# Altium schematic sheet key_pads_sch_V3.SchDoc
size E; DrawnBy: huyong; Engineer: huyong; Organization: LINSN; Address3: http://www.linsn.com/; Revision: V1.0.0
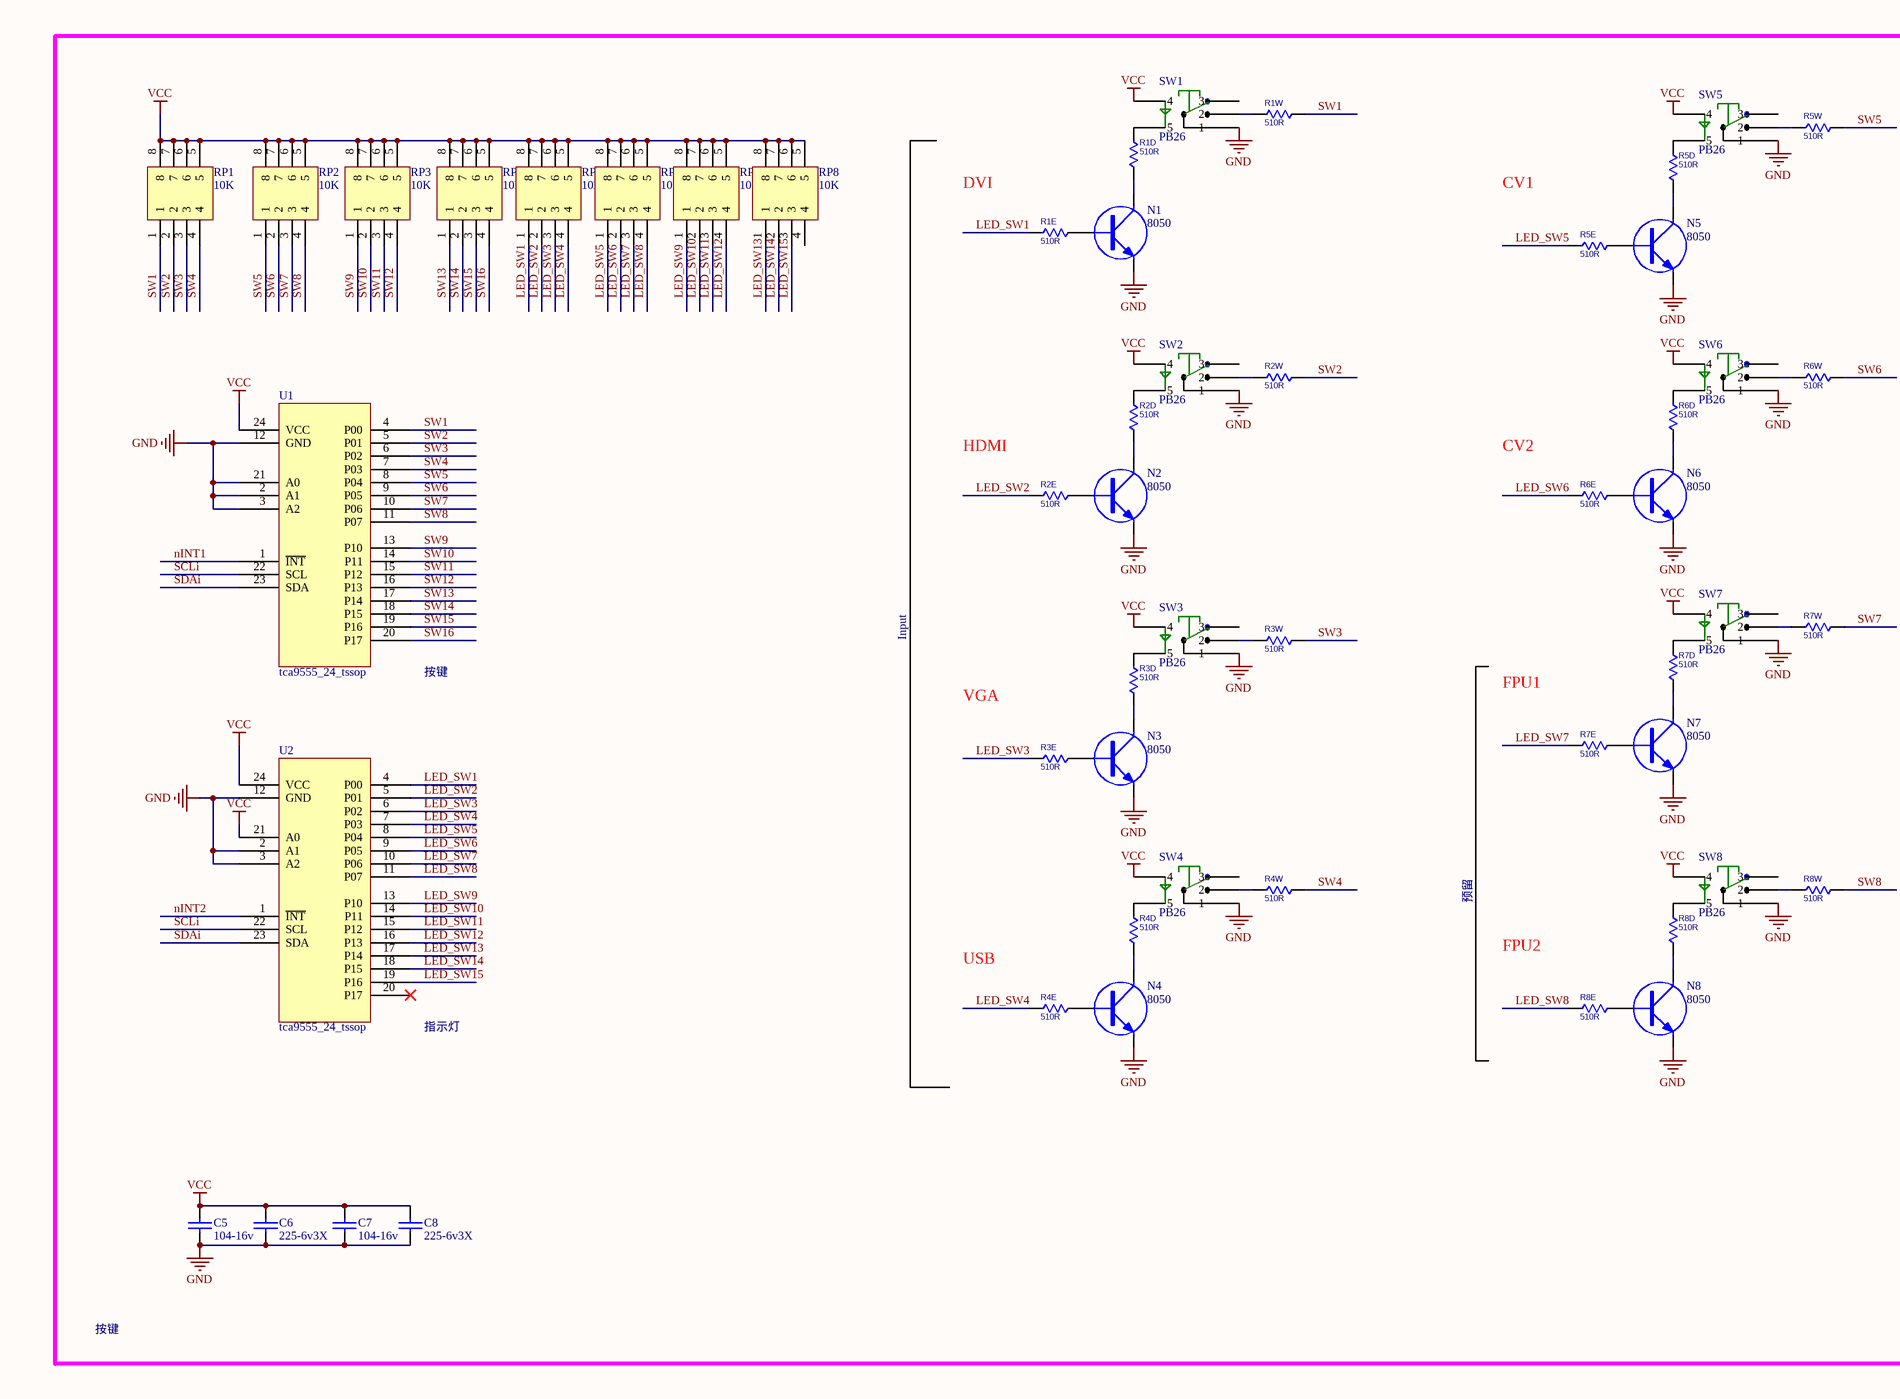
[diagram p0: key_pads_sch_V3.SchDoc, top left]
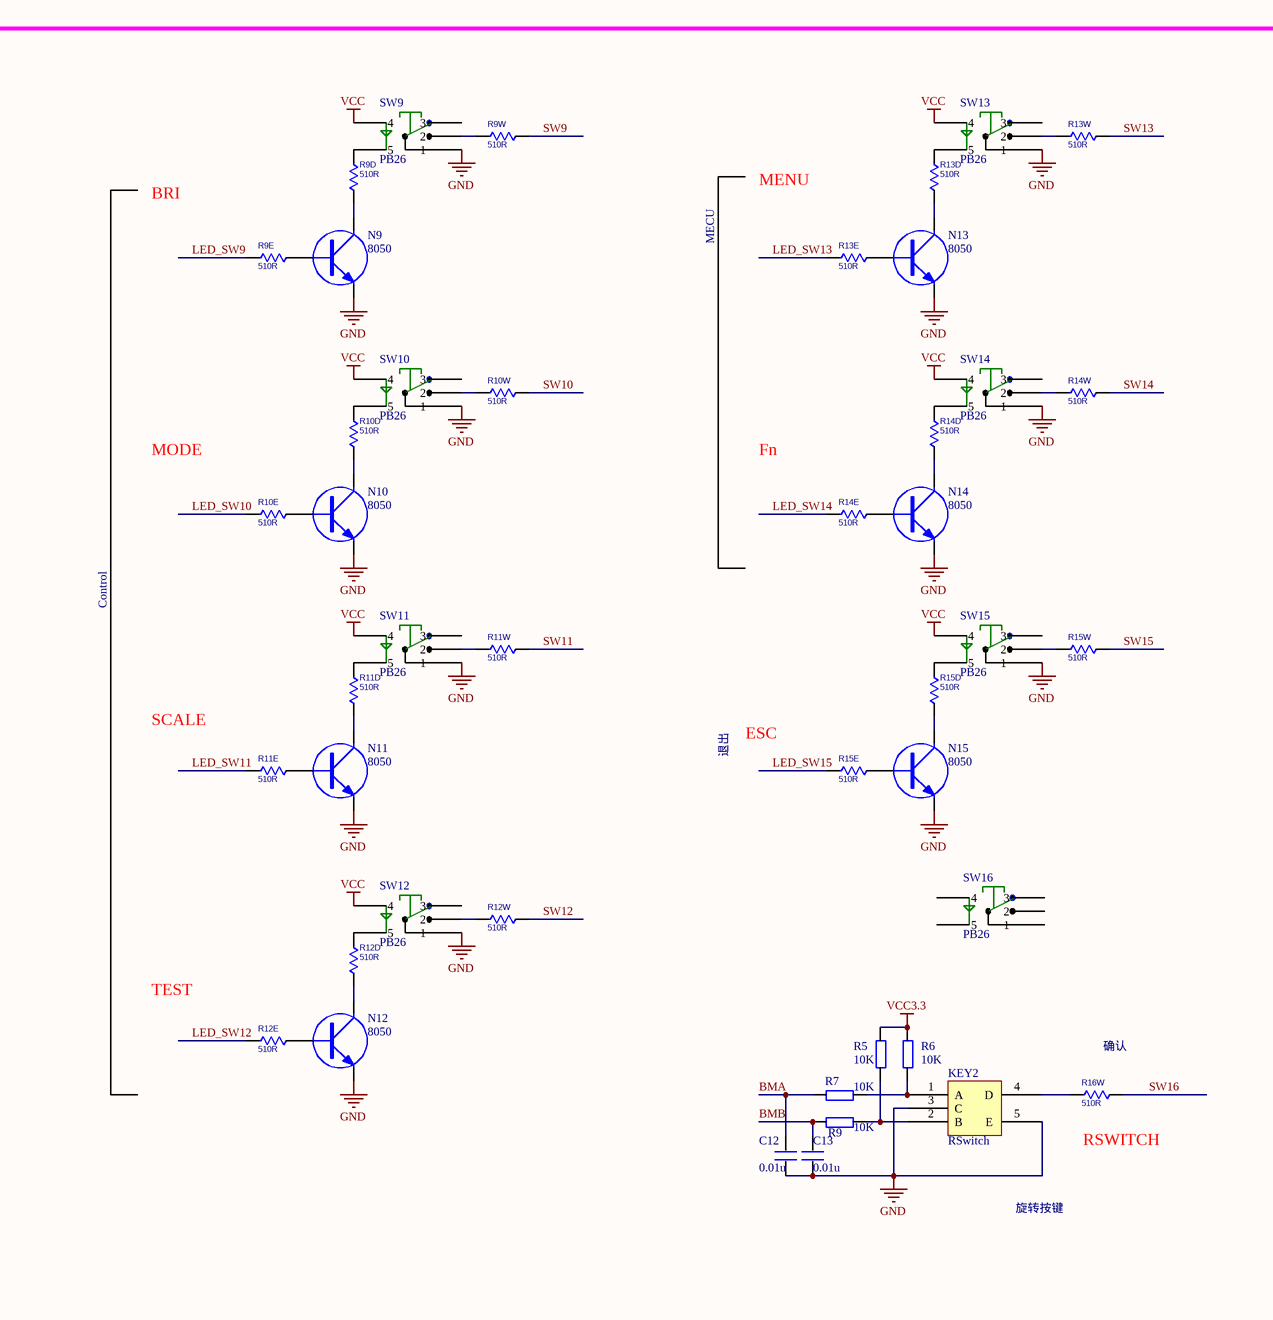
[diagram p1: key_pads_sch_V3.SchDoc, top right]
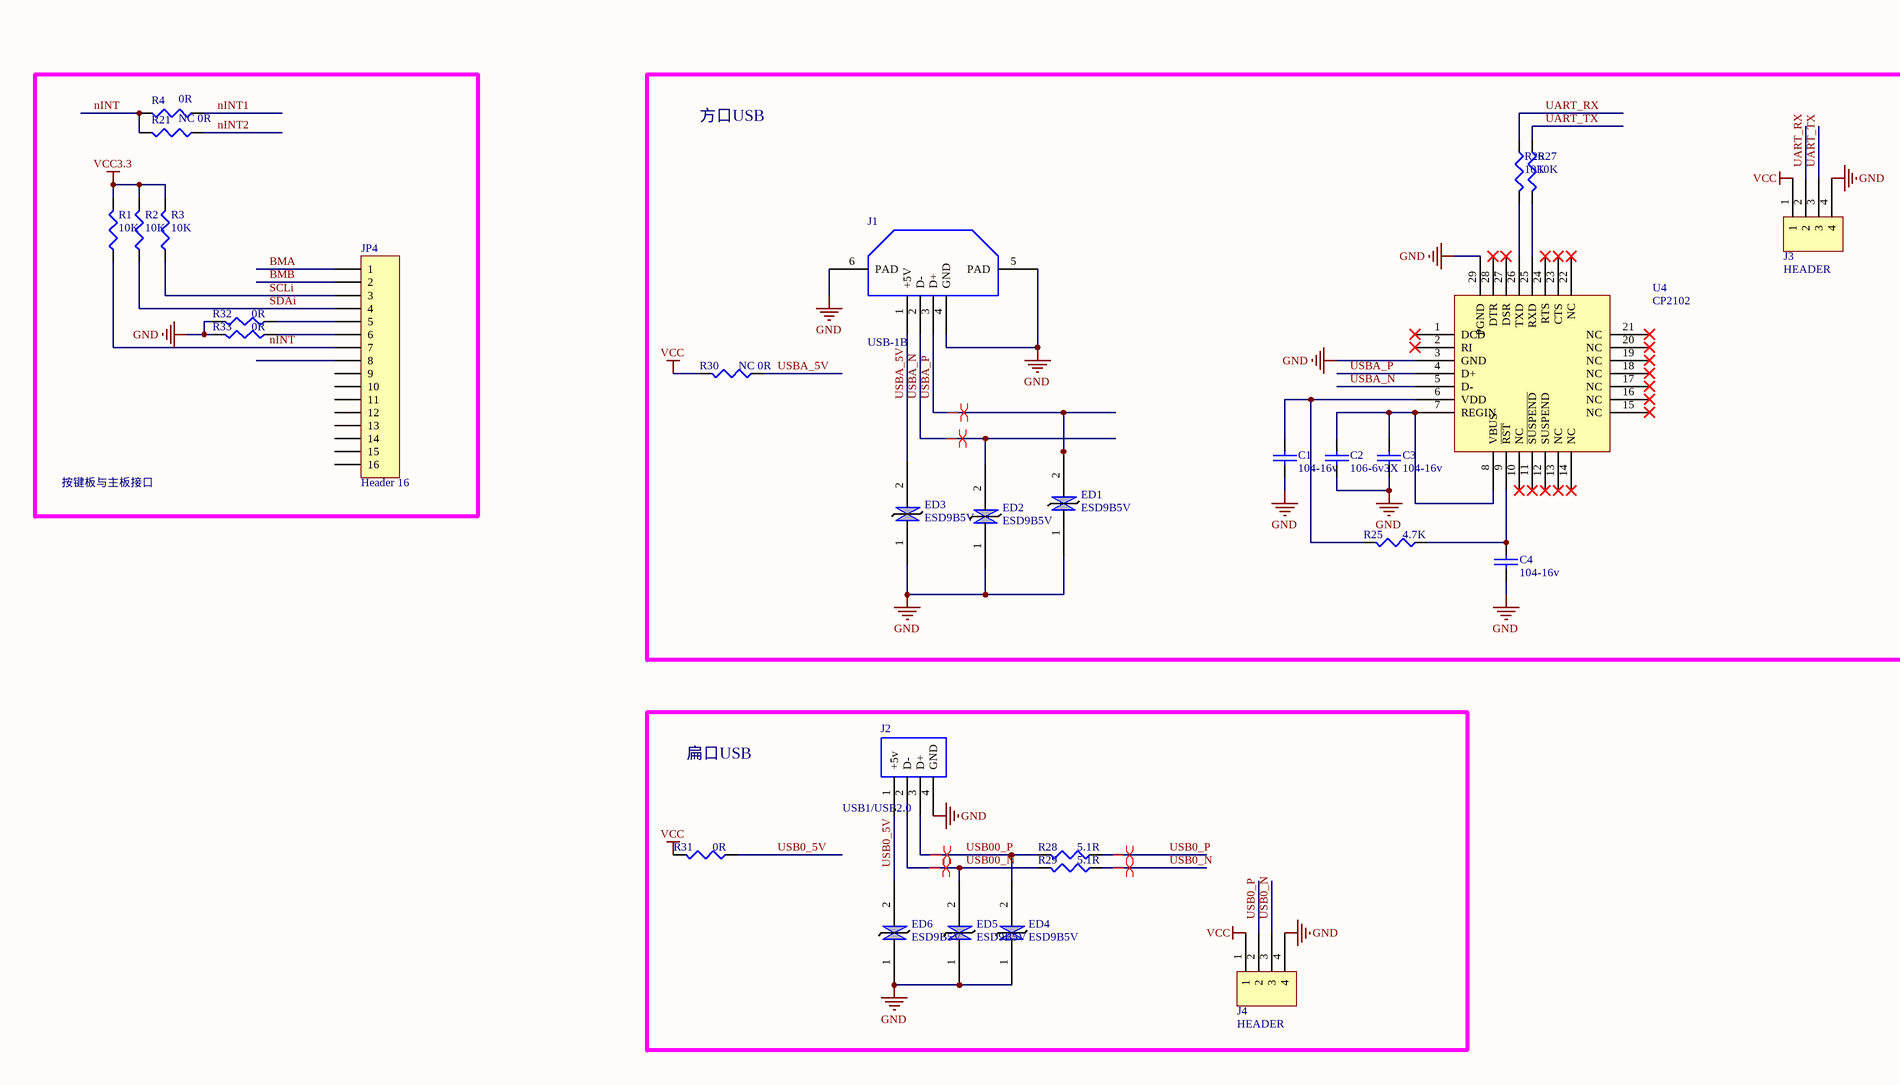
[diagram p2: key_pads_sch_V3.SchDoc, bottom left]
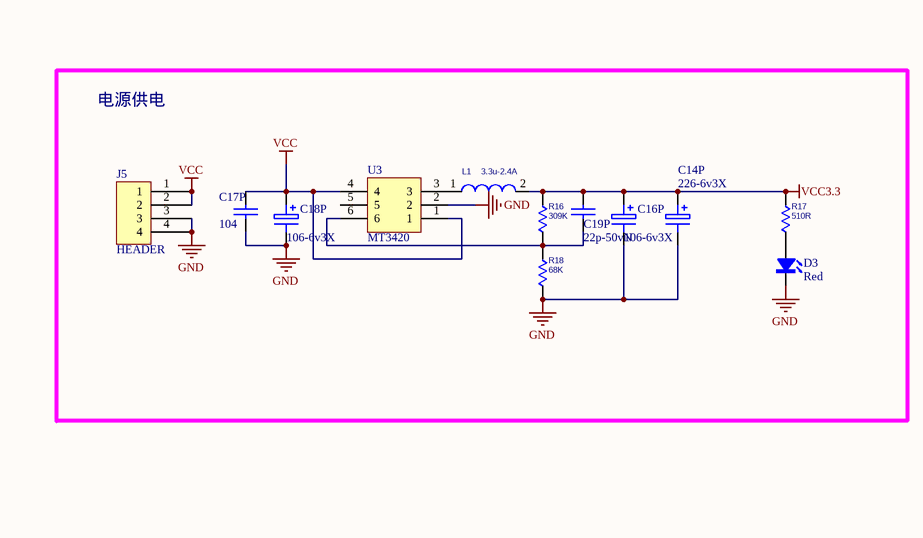
[diagram p3: key_pads_sch_V3.SchDoc, bottom right]

## Parts
C1  104-16v  [C0402]
C2  106-6v3X  [C0402]
C3  104-16v  [C0402]
C4  104-16v  [C0402]
C5  104-16v  [C0402]
C6  225-6v3X  [C0402]
C7  104-16v  [C0402]
C8  225-6v3X  [C0402]
C12  0.01u  [R0402]
C13  0.01u  [R0402]
C14P  226-6v3X  [C0805]
C16P  106-6v3X  [C0603]
C17P  104  [C0402]
C18P  106-6v3X  [C0603]
C19P  22p-50vN  [C0402]
D3  Red  [led0603]
ED1  ESD9B5V  [E0402N]
ED2  ESD9B5V  [E0402N]
ED3  ESD9B5V  [E0402N]
ED4  ESD9B5V  [E0402N]
ED5  ESD9B5V  [E0402N]
ED6  ESD9B5V  [E0402N]
J1  USB-1B  [USB_BF_180]
J2  USB1/USB2.0  [USB_AF_180]
J3  HEADER  [SIP4-2.54]
J4  HEADER  [SIP4-2.54]
J5  HEADER  [SIP4-2.54]
JP4  Header 16  [DJ16J]
KEY2  RSwitch  [RSwitch]
L1  3.3u-2.4A  [L5040]
N1  8050  [sot-23]
N2  8050  [sot-23]
N3  8050  [sot-23]
N4  8050  [sot-23]
N5  8050  [sot-23]
N6  8050  [sot-23]
N7  8050  [sot-23]
N8  8050  [sot-23]
N9  8050  [sot-23]
N10  8050  [sot-23]
N11  8050  [sot-23]
N12  8050  [sot-23]
N13  8050  [sot-23]
N14  8050  [sot-23]
N15  8050  [sot-23]
R1  10K  [R0402]
R1D  510R  [R0402]
R1E  510R  [R0402]
R1W  510R  [R0402]
R2  10K  [R0402]
R2D  510R  [R0402]
R2E  510R  [R0402]
R2W  510R  [R0402]
R3  10K  [R0402]
R3D  510R  [R0402]
R3E  510R  [R0402]
R3W  510R  [R0402]
R4  0R  [R0402]
R4D  510R  [R0402]
R4E  510R  [R0402]
R4W  510R  [R0402]
R5  10K  [R0402]
R5D  510R  [R0402]
R5E  510R  [R0402]
R5W  510R  [R0402]
R6  10K  [R0402]
R6D  510R  [R0402]
R6E  510R  [R0402]
R6W  510R  [R0402]
R7  10K  [R0402]
R7D  510R  [R0402]
R7E  510R  [R0402]
R7W  510R  [R0402]
R8D  510R  [R0402]
R8E  510R  [R0402]
R8W  510R  [R0402]
R9  10K  [R0402]
R9D  510R  [R0402]
R9E  510R  [R0402]
R9W  510R  [R0402]
R10D  510R  [R0402]
R10E  510R  [R0402]
R10W  510R  [R0402]
R11D  510R  [R0402]
R11E  510R  [R0402]
R11W  510R  [R0402]
R12D  510R  [R0402]
R12E  510R  [R0402]
R12W  510R  [R0402]
R13D  510R  [R0402]
R13E  510R  [R0402]
R13W  510R  [R0402]
R14D  510R  [R0402]
R14E  510R  [R0402]
R14W  510R  [R0402]
R15D  510R  [R0402]
R15E  510R  [R0402]
R15W  510R  [R0402]
R16  309K  [R0402]
R16W  510R  [R0402]
R17  510R  [R0402]
R18  68K  [R0402]
R21  NC 0R  [R0402]
R25  4.7K  [R0402]
R26  10K  [R0402]
R27  10K  [R0402]
R28  5.1R  [R0402]
R29  5.1R  [R0402]
R30  NC 0R  [R0402]
R31  0R  [R0402]
R32  0R  [R0402]
R33  0R  [R0402]
RP1  10K  [40402]
RP2  10K  [40402]
RP3  10K  [40402]
RP4  10K  [40402]
RP5  10K  [40402]
RP6  10K  [40402]
RP7  10K  [40402]
RP8  10K  [40402]
SW1  PB26  [PB26]
SW2  PB26  [PB26]
SW3  PB26  [PB26]
SW4  PB26  [PB26]
SW5  PB26  [PB26]
SW6  PB26  [PB26]
SW7  PB26  [PB26]
SW8  PB26  [PB26]
SW9  PB26  [PB26]
SW10  PB26  [PB26]
SW11  PB26  [PB26]
SW12  PB26  [PB26]
SW13  PB26  [PB26]
SW14  PB26  [PB26]
SW15  PB26  [PB26]
SW16  PB26  [PB26]
U1  tca9555_24_tssop  [TSSOP24_TCA9555]
U2  tca9555_24_tssop  [TSSOP24_TCA9555]
U3  MT3420  [SOT26]
U4  CP2102  [QFN28_CP2102]

## Blocks framed on the sheet
按键板与主板接口: JP4 R1-R4 R21 R32 R33
方口USB: C1-C4 ED1-ED3 J1 J3 R25-R27 R30 U4
电源供电: C14P C16P C17P C18P C19P D3 J5 L1 R16-R18 U3
扁口USB: ED4-ED6 J2 J4 R28 R29 R31

## Nets
GND: C1.2 C2.2 C3.2 C4.2 C5.2 C6.2 C7.2 C8.2 C12.1 C13.1 C14P.2 C16P.2 C17P.2 C18P.2 D3.K ED1.1 ED2.1 ED3.1 ED4.1 ED5.1 ED6.1 J1.4(GND) J1.5(PAD) J1.6(PAD) J2.4(GND) J3.4 J4.4 J5.3 J5.4 KEY2.3(C) KEY2.5(E) N1.E N2.E N3.E N4.E N5.E N6.E N7.E N8.E N9.E N10.E N11.E N12.E N13.E N14.E N15.E R18.2 R32.2 R33.2 SW1.1 SW2.1 SW3.1 SW4.1 SW5.1 SW6.1 SW7.1 SW8.1 SW9.1 SW10.1 SW11.1 SW12.1 SW13.1 SW14.1 SW15.1 U1.2(A1) U1.3(A2) U1.12(GND) U1.21(A0) U2.2(A1) U2.3(A2) U2.12(GND) U3.2 U4.3(GND) U4.29(PGND)
VCC: C5.1 C6.1 C7.1 C8.1 C17P.1 C18P.1 J3.1 J4.1 J5.1 J5.2 R30.2 R31.2 RP1.5 RP1.6 RP1.7 RP1.8 RP2.5 RP2.6 RP2.7 RP2.8 RP3.5 RP3.6 RP3.7 RP3.8 RP4.5 RP4.6 RP4.7 RP4.8 RP5.5 RP5.6 RP5.7 RP5.8 RP6.5 RP6.6 RP6.7 RP6.8 RP7.5 RP7.6 RP7.7 RP7.8 RP8.5 RP8.6 RP8.7 RP8.8 SW1.4 SW2.4 SW3.4 SW4.4 SW5.4 SW6.4 SW7.4 SW8.4 SW9.4 SW10.4 SW11.4 SW12.4 SW13.4 SW14.4 SW15.4 U1.24(VCC) U2.21(A0) U2.24(VCC) U3.1 U3.4
VCC3.3: C14P.1 C16P.1 C19P.1 L1.2 R1.2 R2.2 R3.2 R5.2 R6.2 R16.1 R17.1
BMA: C12.2 JP4.1 R7.1
BMB: C13.2 JP4.2 R9.1
LED_SW1: R1E.1 RP5.1 U2.4(P00)
LED_SW2: R2E.1 RP5.2 U2.5(P01)
LED_SW3: R3E.1 RP5.3 U2.6(P02)
LED_SW4: R4E.1 RP5.4 U2.7(P03)
LED_SW5: R5E.1 RP6.1 U2.8(P04)
LED_SW6: R6E.1 RP6.2 U2.9(P05)
LED_SW7: R7E.1 RP6.3 U2.10(P06)
LED_SW8: R8E.1 RP6.4 U2.11(P07)
LED_SW9: R9E.1 RP7.1 U2.13(P10)
LED_SW10: R10E.1 RP7.2 U2.14(P11)
LED_SW11: R11E.1 RP7.3 U2.15(P12)
LED_SW12: R12E.1 RP7.4 U2.16(P13)
LED_SW13: R13E.1 RP8.1 U2.17(P14)
LED_SW14: R14E.1 RP8.2 U2.18(P15)
LED_SW15: R15E.1 RP8.3 U2.19(P16)
nINT: JP4.7 R1.1 R4.2 R21.2
nINT1: R4.1 U1.1(~{INT})
nINT2: R21.1 U2.1(~{INT})
SCLi: JP4.3 R3.1 U1.22(SCL) U2.22(SCL)
SDAi: JP4.4 R2.1 U1.23(SDA) U2.23(SDA)
SW1: R1W.2 RP1.1 U1.4(P00)
SW2: R2W.2 RP1.2 U1.5(P01)
SW3: R3W.2 RP1.3 U1.6(P02)
SW4: R4W.2 RP1.4 U1.7(P03)
SW5: R5W.2 RP2.1 U1.8(P04)
SW6: R6W.2 RP2.2 U1.9(P05)
SW7: R7W.2 RP2.3 U1.10(P06)
SW8: R8W.2 RP2.4 U1.11(P07)
SW9: R9W.2 RP3.1 U1.13(P10)
SW10: R10W.2 RP3.2 U1.14(P11)
SW11: R11W.2 RP3.3 U1.15(P12)
SW12: R12W.2 RP3.4 U1.16(P13)
SW13: R13W.2 RP4.1 U1.17(P14)
SW14: R14W.2 RP4.2 U1.18(P15)
SW15: R15W.2 RP4.3 U1.19(P16)
SW16: R16W.2 RP4.4 U1.20(P17)
UART_RX: J3.2 R26.1
UART_TX: J3.3 R27.1
USB0_5V: ED6.2 J2.1(+5v) R31.1
USB00_N: ED5.2 J2.2(D-) R29.2
USB0_N: J4.3 R29.1
USB00_P: ED4.2 J2.3(D+) R28.2
USB0_P: J4.2 R28.1
USBA_5V: ED3.2 J1.1(+5V) R30.1
USBA_N: ED2.2 J1.2(D-) U4.5(D-)
USBA_P: ED1.2 J1.3(D+) U4.4(D+)
NetC1_1: C1.1 R25.2 U4.6(VDD)
NetC2_1: C2.1 C3.1 U4.7(REGIN) U4.8(VBUS)
NetC4_1: C4.1 R25.1 U4.9(~{RST})
NetC19P_2: C19P.2 R16.2 R18.1 U3.6
NetD3_A: D3.A R17.2
NetJP4_5: JP4.5 R32.1
NetJP4_6: JP4.6 R33.1
NetKEY2_1: KEY2.1(A) R6.1 R7.2
NetKEY2_2: KEY2.2(B) R5.1 R9.2
NetKEY2_4: KEY2.4(D) R16W.1
NetL1_1: L1.1 U3.3
NetN1_B: N1.B R1E.2
NetN1_C: N1.C R1D.2
NetN2_B: N2.B R2E.2
NetN2_C: N2.C R2D.2
NetN3_B: N3.B R3E.2
NetN3_C: N3.C R3D.2
NetN4_B: N4.B R4E.2
NetN4_C: N4.C R4D.2
NetN5_B: N5.B R5E.2
NetN5_C: N5.C R5D.2
NetN6_B: N6.B R6E.2
NetN6_C: N6.C R6D.2
NetN7_B: N7.B R7E.2
NetN7_C: N7.C R7D.2
NetN8_B: N8.B R8E.2
NetN8_C: N8.C R8D.2
NetN9_B: N9.B R9E.2
NetN9_C: N9.C R9D.2
NetN10_B: N10.B R10E.2
NetN10_C: N10.C R10D.2
NetN11_B: N11.B R11E.2
NetN11_C: N11.C R11D.2
NetN12_B: N12.B R12E.2
NetN12_C: N12.C R12D.2
NetN13_B: N13.B R13E.2
NetN13_C: N13.C R13D.2
NetN14_B: N14.B R14E.2
NetN14_C: N14.C R14D.2
NetN15_B: N15.B R15E.2
NetN15_C: N15.C R15D.2
NetR1D_1: R1D.1 SW1.5
NetR1W_1: R1W.1 SW1.2
NetR2D_1: R2D.1 SW2.5
NetR2W_1: R2W.1 SW2.2
NetR3D_1: R3D.1 SW3.5
NetR3W_1: R3W.1 SW3.2
NetR4D_1: R4D.1 SW4.5
NetR4W_1: R4W.1 SW4.2
NetR5D_1: R5D.1 SW5.5
NetR5W_1: R5W.1 SW5.2
NetR6D_1: R6D.1 SW6.5
NetR6W_1: R6W.1 SW6.2
NetR7D_1: R7D.1 SW7.5
NetR7W_1: R7W.1 SW7.2
NetR8D_1: R8D.1 SW8.5
NetR8W_1: R8W.1 SW8.2
NetR9D_1: R9D.1 SW9.5
NetR9W_1: R9W.1 SW9.2
NetR10D_1: R10D.1 SW10.5
NetR10W_1: R10W.1 SW10.2
NetR11D_1: R11D.1 SW11.5
NetR11W_1: R11W.1 SW11.2
NetR12D_1: R12D.1 SW12.5
NetR12W_1: R12W.1 SW12.2
NetR13D_1: R13D.1 SW13.5
NetR13W_1: R13W.1 SW13.2
NetR14D_1: R14D.1 SW14.5
NetR14W_1: R14W.1 SW14.2
NetR15D_1: R15D.1 SW15.5
NetR15W_1: R15W.1 SW15.2
NetR26_2: R26.2 U4.26(TXD)
NetR27_2: R27.2 U4.25(RXD)

Not connected (* = marked no-connect by the designer): JP4 8 9 10 11 12 13 14 15 16; RP8 4; SW1 3; SW2 3; SW3 3; SW4 3; SW5 3; SW6 3; SW7 3; SW8 3; SW9 3; SW10 3; SW11 3; SW12 3; SW13 3; SW14 3; SW15 3; SW16 1 2 3 4 5; U2 20(P17)*; U3 5; U4 1(DCD)* 2(RI)* 10(NC)* 11(~{SUSPEND})* 12(SUSPEND)* 13(NC)* 14(NC)* 15(NC)* 16(NC)* 17(NC)* 18(NC)* 19(NC)* 20(NC)* 21(NC)* 22(NC)* 23(CTS)* 24(RTS)* 27(DSR)* 28(DTR)*

## Layout directives
differential pair: USB0_N, USB00_N, USB00_P, USB0_P, USBA_N, USBA_P

## Notes on the sheet
- DVI
- CV1
- BRI
- MENU
- MECU
- HDMI
- CV2
- MODE
- Fn
- Control
- 按键
- Input
- FPU1
- VGA
- SCALE
- 退出
- ESC
- 预留
- FPU2
- USB
- TEST
- 指示灯
- (near R16W) 确认
- (near R16W) RSWITCH
- 旋转按键
- Title:
- Size:
- Date:
- E
- Number:
- CHECK:
- Author:
- Revision:
- Sheet
- of
- File:

## Library data of the parts
C1-C8 = CAP
C12 C13 = C
C14P C16P C18P = ELECTRO
C17P C19P = CAP: Capacitor
D3 = LED
J3-J5 = 4PIN
JP4 = Header 16: Header, 16-Pin; LatestRevisionDate: 17-Jul-2002; LatestRevisionNote: Re-released for DXP Platform.; Publisher: Altium Limited
L1 = L_Dup1: Right: 20; Bottom: 40
N1-N15 = NPN
R1-R4 R21 R25-R33 = RES
R1D R1E R1W R2D R2E R2W R3D R3E R3W R4D R4E R4W R5D R5E R5W R6D R6E R6W R7D R7E R7W R8D R8E R8W R9D R9E R9W R10D R10E R10W R11D R11E R11W R12D R12E R12W R13D R13E R13W R14D R14E R14W R15D R15E R15W R16 R16W R17 R18 = R: RES 37.4 OHM 1/16W 1% 0402 SMD; Manufacturer: Vishay/Dale; Manufacturer Part Num: CRCW040237R4FKED; COMPGROUP: 1; COMPSIDE: BOT; COMPLOC: [4288.000,2355.000]; COMPROT: 270; COMPFIXED: NO; COMPHEIGHT: 0.000; COMPLOCKED: NO; COMPKEY: NO; DECOUPLER: NO; MEMORY: NO; Digikey Part#: 541-37.4LCT-ND
R5-R7 R9 = R
RP1-RP8 = DIP8
U3 = DIP6